# EAGLE schematic PIC24F04KA201.v01 (EAGLE 6.6.0)
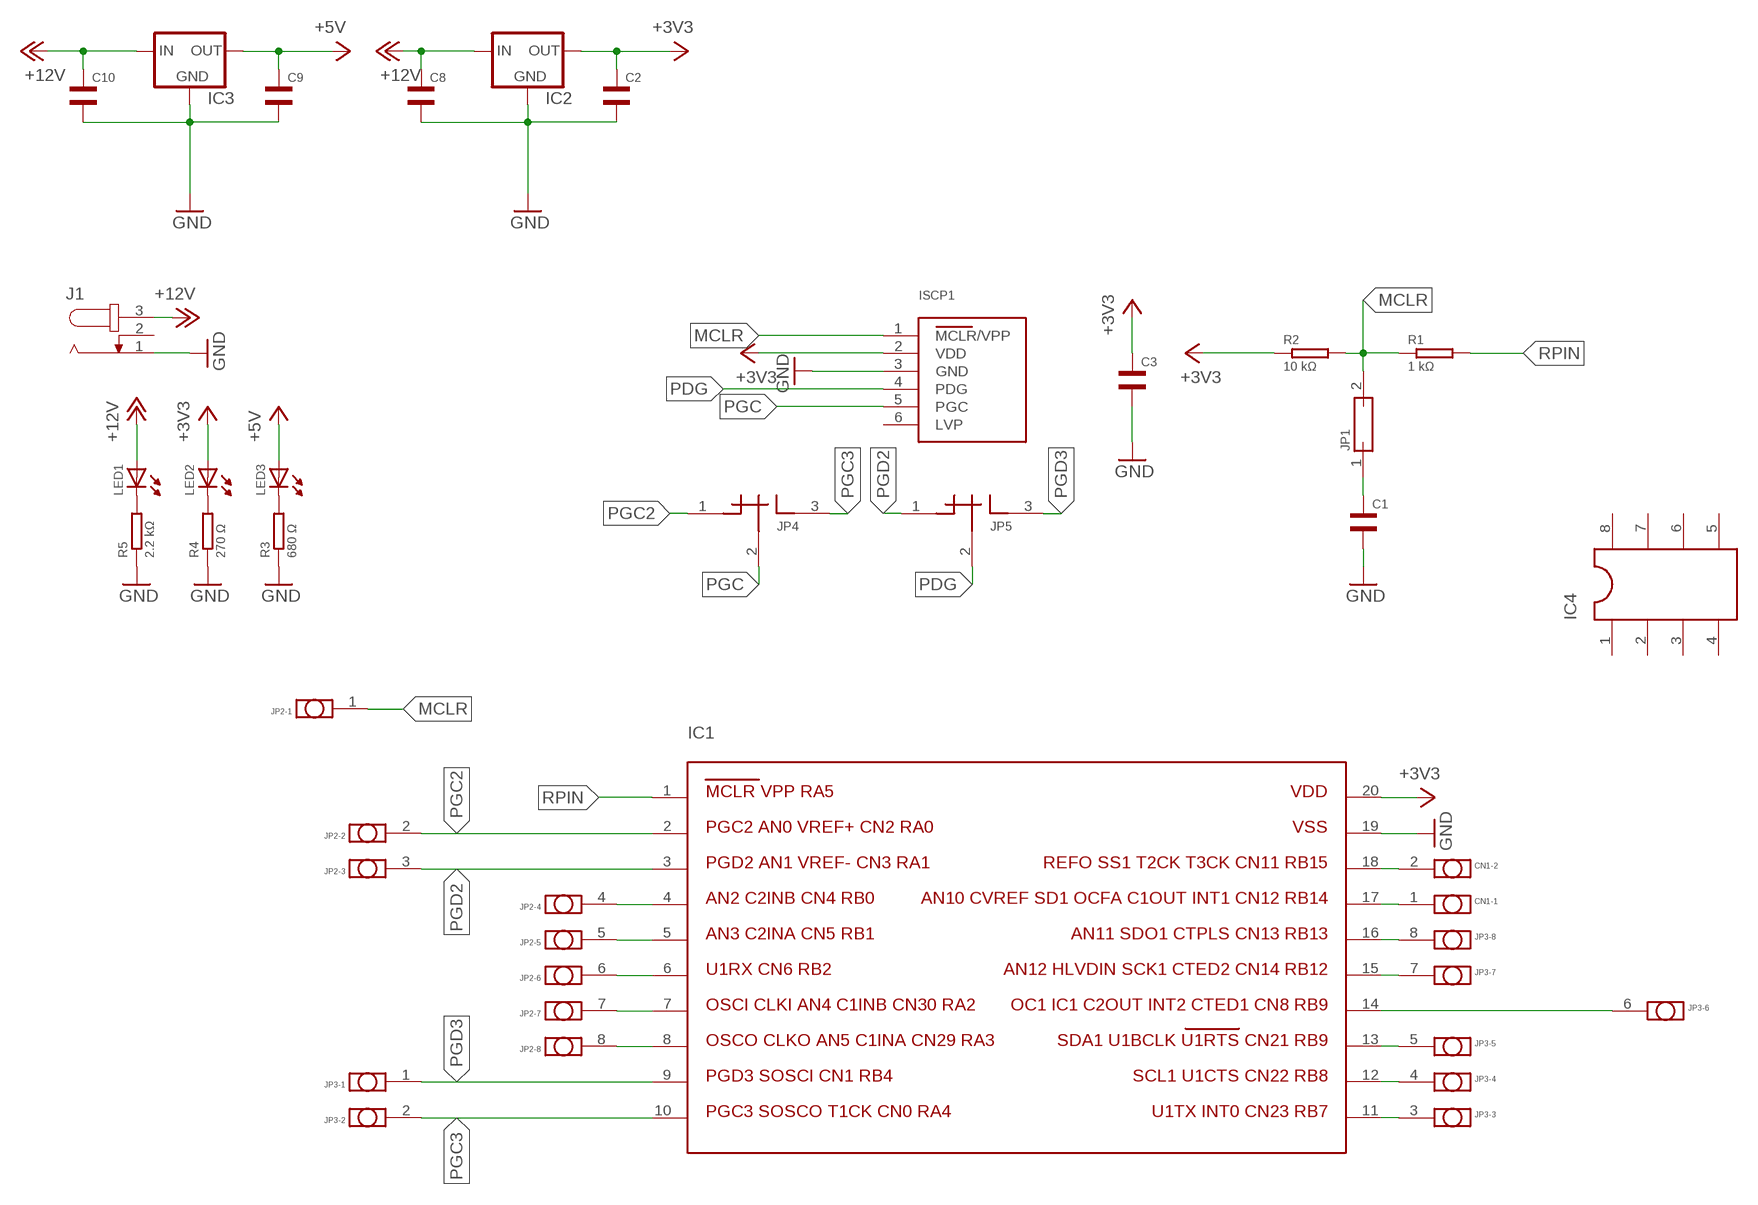
[diagram p0: schematic, sheet 1]

## Parts
C1  CAP-SMD-0805  [SMD-0805]
C2  CAP-SMD-0805  [SMD-0805]
C3  CAP-SMD-0805  [SMD-0805]
C8  CAP-SMD-0805  [SMD-0805]
C9  CAP-SMD-0805  [SMD-0805]
C10  CAP-SMD-0805  [SMD-0805]
CN1  1X2  [1X2]
IC1  PIC24F04KA201  [DIP-20-SOCKET]
IC2  LD1117V33  [TO-220-STANDING]
IC3  L78S05CV  [TO-220-STANDING]
IC4  DIP-08S  [DIP-08-SOCKET]
ISCP1  ICSP1X6-2.54  [1X6-2.54]
J1  JACK-PLUG0  [SPC4077]
JP1  JP  [1X2]
JP2  1X8  [1X8]
JP3  1X8  [1X8]
JP4  JP-OR  [1X3]
JP5  JP-OR  [1X3]
LED1  LED-SMD-0805  [SMD-0805]
LED2  LED-SMD-0805  [SMD-0805]
LED3  LED-SMD-0805  [SMD-0805]
R1  1 kΩ  CRCW08051K00FKTABC  [SMD-2012(0805)]
R2  10 kΩ  CRCW080510K0FKTABC  [SMD-2012(0805)]
R3  680 Ω  CRCW0805680RFKTABC  [SMD-2012(0805)]
R4  270 Ω  CRCW0805270RFKTABC  [SMD-2012(0805)]
R5  2.2 kΩ  CRCW08052K20FKTABC  [SMD-2012(0805)]

## Nets
+3V3: C2.2 C3.2 IC1.20 IC2.2(OUT) ISCP1.2(VDD) LED2.A R2.1
+5V: C9.2 IC3.3(OUT) LED3.A
+12V: C8.2 C10.2 IC2.3(IN) IC3.1(IN) J1.3 LED1.A
GND: C1.1 C2.1 C3.1 C8.1 C9.1 C10.1 IC1.19 IC2.1(GND) IC3.2(GND) ISCP1.3(GND) J1.1 R3.1 R4.1 R5.1
MCLR: ISCP1.1(MCLR/VPP) JP1.2 JP2.1 R1.1 R2.2
N$1: C1.2 JP1.1
N$4: IC1.4 JP2.4
N$5: LED3.C R3.2
N$6: LED2.C R4.2
N$7: LED1.C R5.2
N$8: IC1.6 JP2.6
N$9: IC1.5 JP2.5
N$10: IC1.7 JP2.7
N$11: IC1.8 JP2.8
N$12: IC1.16 JP3.8
N$13: IC1.15 JP3.7
N$14: IC1.14 JP3.6
N$15: IC1.13 JP3.5
N$16: IC1.12 JP3.4
N$17: IC1.11 JP3.3
N$18: CN1.1 IC1.17
N$19: CN1.2 IC1.18
PDG: ISCP1.4(PDG) JP5.2
PGC: ISCP1.5(PGC) JP4.2
PGC2: IC1.2 JP2.2 JP4.1
PGC3: IC1.10 JP3.2 JP4.3
PGD2: IC1.3 JP2.3 JP5.1
PGD3: IC1.9 JP3.1 JP5.3
RPIN: IC1.1 R1.2
Unconnected: IC4.1 IC4.2 IC4.3 IC4.4 IC4.5 IC4.6 IC4.7 IC4.8 ISCP1.6(LVP) J1.2

## Library data of the parts
C1-C3 C8-C10 = SM-Capacitors:CAP
CN1 = SM-PinHeader:1X2
IC1 = SM-Microchip:PIC24F04KA201
IC2 = SM-VReg:LD1117V33; CURRENT: 0.8 A; MANUFACTURER: ST Microelectronics; PACKAGE: TO-220; TME: LD1117V33; VIN-MAX: 15.0 V; VIN-MIN: 4.5V; VOUT: 3.3 V
IC3 = SM-VReg:L78S05CV; CURRENT: 2.0 A; MANUFACTURER: St Microelectronics; PACKAGE: TO-220; TME: L78S05CV; VIN-MAX: 35.0 V; VIN-MIN: 8.0 V; VOUT: 5.0 V
IC4 = SM-IC-Packages:DIP-08: Dual In Line / Socket
ISCP1 = SM-Microchip:ICSP
J1 = SM-CON-DC_JACK:JACK-PLUG: DC POWER JACK Power Jack, DC, Right Angle, Through Hole, Rated 5A at 16VDC, PC Terminals Distributor: Farnell (www.Farnell.de) Drawing: 84N1161.pdf / 84N1162.pdf Manufacturer: SPC Technology (www.spctechnology.com) Type: SPC4077 / SPC 4078; OC_FARNELL: unknown; OC_NEWARK: unknown
JP1 = SM-Jumper:JP
JP2 JP3 = SM-PinHeader:1X8
JP4 JP5 = SM-Jumper:JP-OR
LED1-LED3 = SM-LED:LED
R1 = SM-Resistor:CRCW0805: Vishay thick film SMD resistors; MANUFACTURER: Vishay; PACKAGE: SMD-2012(0805); POWER: 0.125 W; TCR: 100 ppm/K; TME: CRCW08051K00FKTABC; TOLERANCE: 1%
R2 = SM-Resistor:CRCW0805: Vishay thick film SMD resistors; MANUFACTURER: Vishay; PACKAGE: SMD-2012(0805); POWER: 0.125 W; TCR: 100 ppm/K; TME: CRCW080510K0FKTABC; TOLERANCE: 1%
R3 = SM-Resistor:CRCW0805: Vishay thick film SMD resistors; MANUFACTOR: Vishay; PACKAGE: SMD-2012(0805); POWER: 0.125 W; TCR: 100 ppm/K; TME: CRCW0805680RFKTABC; TOLERANCE: 1%
R4 = SM-Resistor:CRCW0805: Vishay thick film SMD resistors; MANUFACTOR: Vishay; PACKAGE: SMD-2012(0805); POWER: 0.125 W; TCR: 100 ppm/K; TME: CRCW0805270RFKTABC; TOLERANCE: 1%
R5 = SM-Resistor:CRCW0805: Vishay thick film SMD resistors; MANUFACTURER: Vishay; PACKAGE: SMD-2012(0805); POWER: 0.125 W; TCR: 100 ppm/K; TME: CRCW08052K20FKTABC; TOLERANCE: 1%